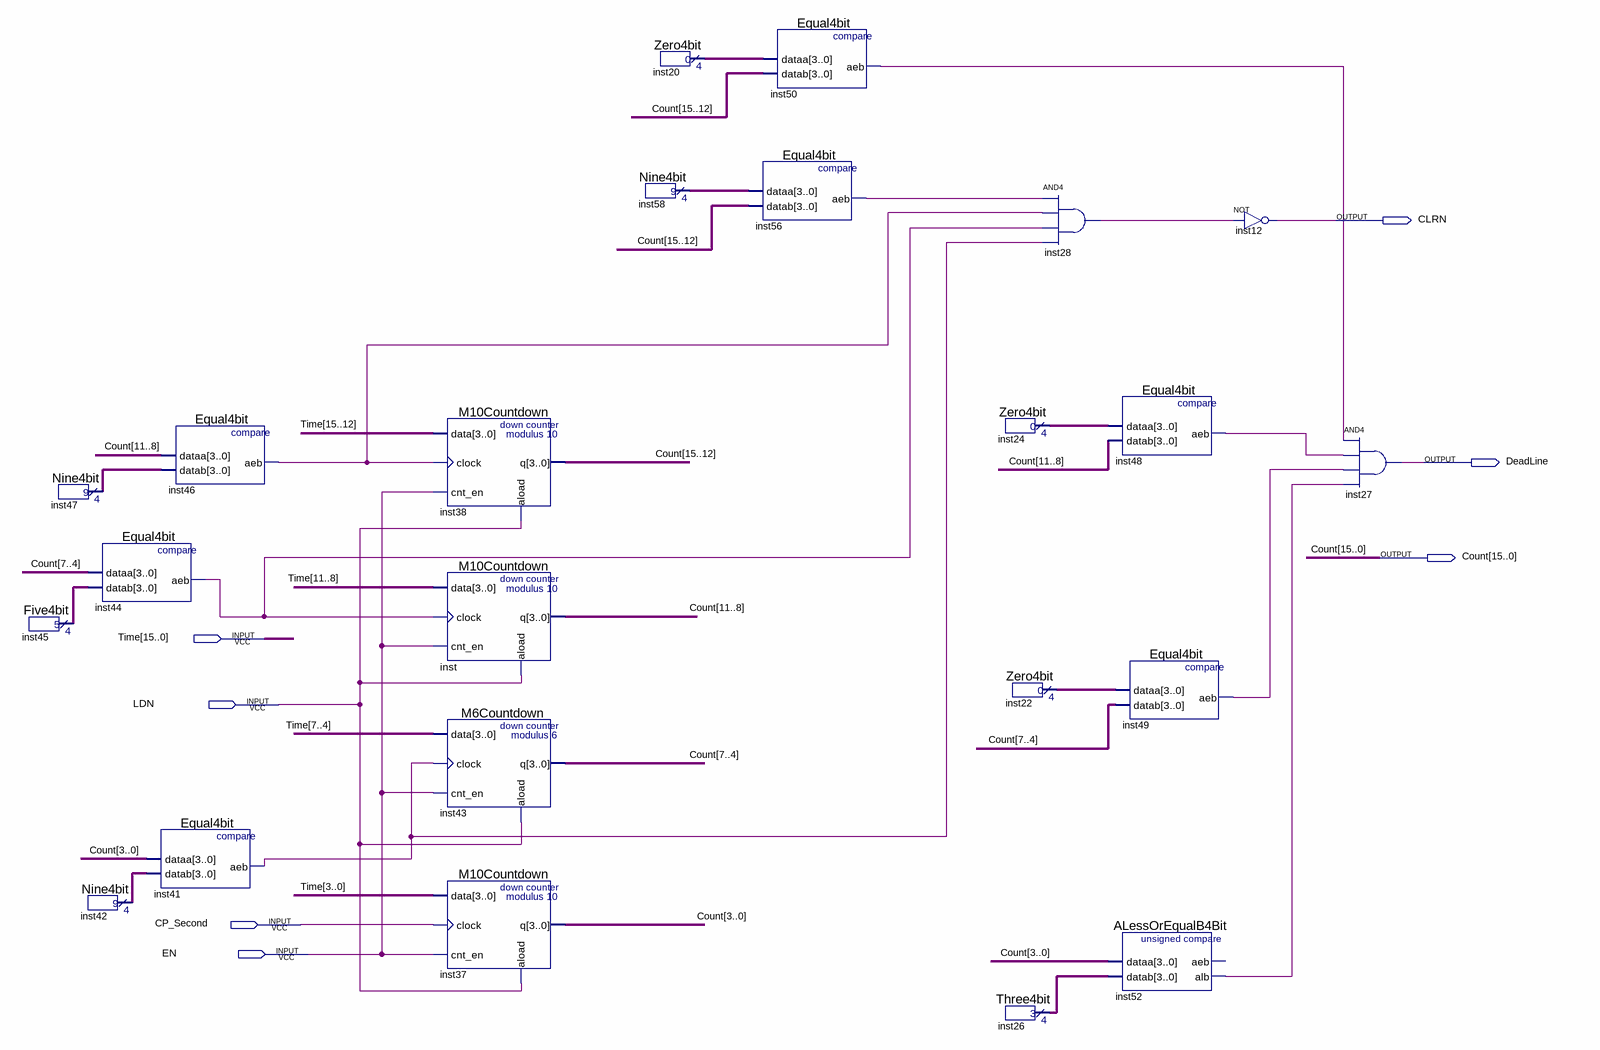
[diagram p0: schematic sheet]
// Quartus schematic CountDownTimer.bdf as structural Verilog: 23 symbols, 7 pins
module CountDownTimer (
  input  [15:0] Time,
  input  LDN,
  input  CP_Second,
  input  EN,
  output CLRN,
  output DeadLine,
  output [15:0] Count
);

  wire inst28_out, inst41_aeb, inst44_aeb, inst46_aeb, inst48_aeb, inst49_aeb, inst50_aeb, inst52_alb,
       inst56_aeb;
  wire [3:0] inst20_result, inst22_result, inst24_result, inst26_result, inst42_result, inst45_result,
       inst47_result, inst58_result;

  Nine4bit inst47 (.result(inst47_result));
  Five4bit inst45 (.result(inst45_result));
  Equal4bit inst44 (.dataa(Count[7:4]), .datab(inst45_result), .aeb(inst44_aeb));
  Nine4bit inst42 (.result(inst42_result));
  Equal4bit inst46 (.dataa(Count[11:8]), .datab(inst47_result), .aeb(inst46_aeb));
  Equal4bit inst41 (.dataa(Count[3:0]), .datab(inst42_result), .aeb(inst41_aeb));
  M10Countdown inst38 (.data(Time[15:12]), .clock(inst46_aeb), .cnt_en(EN), .aload(LDN), .q(Count[15:12]));
  M10Countdown inst (.data(Time[11:8]), .clock(inst44_aeb), .cnt_en(EN), .aload(LDN), .q(Count[11:8]));
  M6Countdown inst43 (.data(Time[7:4]), .clock(inst41_aeb), .cnt_en(EN), .aload(LDN), .q(Count[7:4]));
  M10Countdown inst37 (.data(Time[3:0]), .clock(CP_Second), .cnt_en(EN), .aload(LDN), .q(Count[3:0]));
  Zero4bit inst20 (.result(inst20_result));
  Nine4bit inst58 (.result(inst58_result));
  Equal4bit inst50 (.dataa(inst20_result), .datab(Count[15:12]), .aeb(inst50_aeb));
  Equal4bit inst56 (.dataa(inst58_result), .datab(Count[15:12]), .aeb(inst56_aeb));
  Zero4bit inst24 (.result(inst24_result));
  Zero4bit inst22 (.result(inst22_result));
  Three4bit inst26 (.result(inst26_result));
  and inst28 (inst28_out, inst56_aeb, inst46_aeb, inst44_aeb, inst41_aeb);
  Equal4bit inst48 (.dataa(inst24_result), .datab(Count[11:8]), .aeb(inst48_aeb));
  Equal4bit inst49 (.dataa(inst22_result), .datab(Count[7:4]), .aeb(inst49_aeb));
  ALessOrEqualB4Bit inst52 (.dataa(Count[3:0]), .datab(inst26_result), .alb(inst52_alb));  // open: aeb
  not inst12 (CLRN, inst28_out);
  and inst27 (DeadLine, inst50_aeb, inst48_aeb, inst49_aeb, inst52_alb);
endmodule
